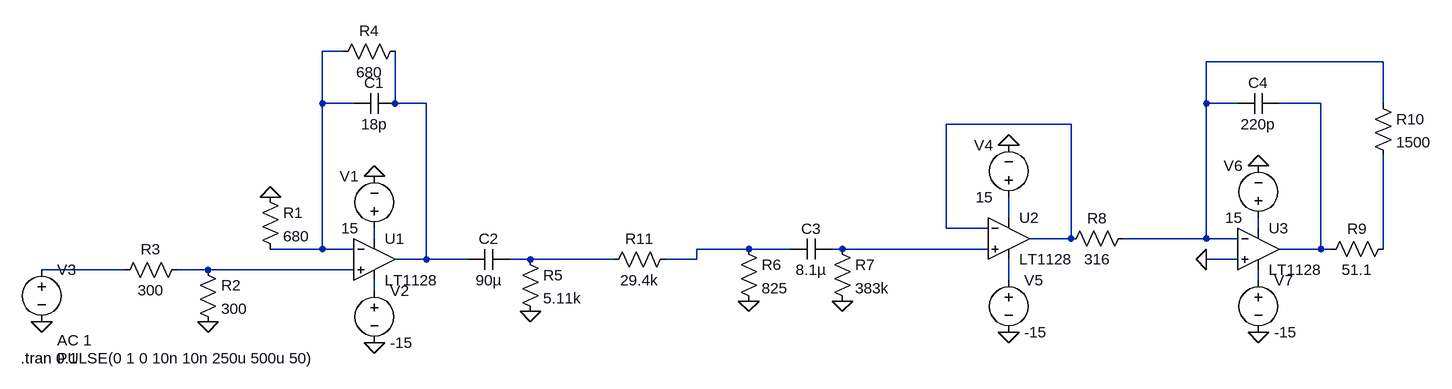
[diagram p0: schematic Circuit_from_a_microwave_freq_counter.asc]
Circuit_from_a_microwave_freq_counter.asc, the LTspice schematic file:
Version 4
SHEET 1 1876 680
WIRE 192 -176 160 -176
WIRE 1792 -160 1520 -160
WIRE 160 -96 160 -176
WIRE 208 -96 160 -96
WIRE 272 -96 272 -176
WIRE 320 -96 272 -96
WIRE 1520 -96 1520 -160
WIRE 1568 -96 1520 -96
WIRE 1696 -96 1632 -96
WIRE 1792 -96 1792 -160
WIRE 1312 -64 1120 -64
WIRE 1216 80 1216 48
WIRE 1120 96 1120 -64
WIRE 1184 96 1120 96
WIRE 1600 96 1600 80
WIRE 240 112 240 96
WIRE 1312 112 1312 -64
WIRE 1312 112 1248 112
WIRE 1520 112 1520 -96
WIRE 1520 112 1392 112
WIRE 1568 112 1520 112
WIRE 160 128 160 -96
WIRE 160 128 80 128
WIRE 208 128 160 128
WIRE 816 128 736 128
WIRE 880 128 816 128
WIRE 960 128 944 128
WIRE 1184 128 960 128
WIRE 1696 128 1696 -96
WIRE 1696 128 1632 128
WIRE 1712 128 1696 128
WIRE 1792 128 1792 -16
WIRE 320 144 320 -96
WIRE 320 144 272 144
WIRE 384 144 320 144
WIRE 480 144 448 144
WIRE 608 144 480 144
WIRE 736 144 736 128
WIRE 736 144 688 144
WIRE 1568 144 1520 144
WIRE -144 160 -272 160
WIRE -16 160 -64 160
WIRE 208 160 -16 160
WIRE 1216 176 1216 144
WIRE 1600 176 1600 160
WIRE 240 192 240 176
FLAG 80 48 0
FLAG -16 240 0
FLAG 240 16 0
FLAG 240 272 0
FLAG 480 224 0
FLAG -272 240 0
FLAG 816 208 0
FLAG 960 208 0
FLAG 1216 -32 0
FLAG 1216 256 0
FLAG 1600 0 0
FLAG 1600 256 0
FLAG 1520 144 0
SYMBOL OpAmps\\LT1128 240 80 R0
SYMATTR InstName U1
SYMBOL res 64 32 R0
SYMATTR InstName R1
SYMATTR Value 680
SYMBOL res -32 144 R0
SYMATTR InstName R2
SYMATTR Value 300
SYMBOL res -48 144 R90
WINDOW 0 0 56 VBottom 2
WINDOW 3 32 56 VTop 2
SYMATTR InstName R3
SYMATTR Value 300
SYMBOL voltage 240 112 R180
WINDOW 0 24 96 Left 2
WINDOW 3 24 16 Left 2
WINDOW 123 0 0 Left 0
WINDOW 39 0 0 Left 0
SYMATTR InstName V1
SYMATTR Value 15
SYMBOL voltage 240 176 R0
WINDOW 123 0 0 Left 0
WINDOW 39 0 0 Left 0
SYMATTR InstName V2
SYMATTR Value -15
SYMBOL cap 272 -112 R90
WINDOW 0 0 32 VBottom 2
WINDOW 3 32 32 VTop 2
SYMATTR InstName C1
SYMATTR Value 18p
SYMBOL res 288 -192 R90
WINDOW 0 0 56 VBottom 2
WINDOW 3 32 56 VTop 2
SYMATTR InstName R4
SYMATTR Value 680
SYMBOL cap 448 128 R90
WINDOW 0 0 32 VBottom 2
WINDOW 3 32 32 VTop 2
SYMATTR InstName C2
SYMATTR Value 90µ
SYMBOL res 464 128 R0
SYMATTR InstName R5
SYMATTR Value 5.11k
SYMBOL voltage -272 144 R0
WINDOW 3 24 152 Left 2
WINDOW 123 24 124 Left 2
WINDOW 39 0 0 Left 0
SYMATTR Value PULSE(0 1 0 10n 10n 250u 500u 50)
SYMATTR Value2 AC 1
SYMATTR InstName V3
SYMBOL res 800 112 R0
SYMATTR InstName R6
SYMATTR Value 825
SYMBOL cap 944 112 R90
WINDOW 0 0 32 VBottom 2
WINDOW 3 32 32 VTop 2
SYMATTR InstName C3
SYMATTR Value 8.1µ
SYMBOL res 944 112 R0
SYMATTR InstName R7
SYMATTR Value 383k
SYMBOL OpAmps\\LT1128 1216 48 R0
SYMATTR InstName U2
SYMBOL voltage 1216 64 R180
WINDOW 0 24 96 Left 2
WINDOW 3 24 16 Left 2
WINDOW 123 0 0 Left 0
WINDOW 39 0 0 Left 0
SYMATTR InstName V4
SYMATTR Value 15
SYMBOL voltage 1216 160 R0
WINDOW 123 0 0 Left 0
WINDOW 39 0 0 Left 0
SYMATTR InstName V5
SYMATTR Value -15
SYMBOL res 1408 96 R90
WINDOW 0 0 56 VBottom 2
WINDOW 3 32 56 VTop 2
SYMATTR InstName R8
SYMATTR Value 316
SYMBOL OpAmps\\LT1128 1600 64 R0
SYMATTR InstName U3
SYMBOL voltage 1600 96 R180
WINDOW 0 24 96 Left 2
WINDOW 3 24 16 Left 2
WINDOW 123 0 0 Left 0
WINDOW 39 0 0 Left 0
SYMATTR InstName V6
SYMATTR Value 15
SYMBOL voltage 1600 160 R0
WINDOW 123 0 0 Left 0
WINDOW 39 0 0 Left 0
SYMATTR InstName V7
SYMATTR Value -15
SYMBOL cap 1632 -112 R90
WINDOW 0 0 32 VBottom 2
WINDOW 3 32 32 VTop 2
SYMATTR InstName C4
SYMATTR Value 220p
SYMBOL res 1808 112 R90
WINDOW 0 0 56 VBottom 2
WINDOW 3 32 56 VTop 2
SYMATTR InstName R9
SYMATTR Value 51.1
SYMBOL res 1776 -112 R0
SYMATTR InstName R10
SYMATTR Value 1500
SYMBOL res 704 128 R90
WINDOW 0 0 56 VBottom 2
WINDOW 3 32 56 VTop 2
SYMATTR InstName R11
SYMATTR Value 29.4k
TEXT -304 296 Left 2 !.tran 0.1

The netlist it stands for:
* Circuit_from_a_microwave_freq_counter.asc
XU1 N014 N001 N008 N017 N003 LT1128  ; pins In+ In- V+ V- OUT
R1 0 N001 680
R2 N014 0 300
R3 N014 N013 300
V1 N008 0 15
V2 N017 0 -15
C1 N003 N001 18p
R4 N003 N001 680
C2 N012 N003 90µ
R5 N012 0 5.11k
V3 N013 0 PULSE(0 1 0 10n 10n 250u 500u 50) AC 1
R6 N009 0 825
C3 N010 N009 8.1µ
R7 N010 0 383k
XU2 N010 N005 N006 N015 N005 LT1128  ; pins In+ In- V+ V- OUT
V4 N006 0 15
V5 N015 0 -15
R8 N002 N005 316
XU3 0 N002 N007 N016 N004 LT1128  ; pins In+ In- V+ V- OUT
V6 N007 0 15
V7 N016 0 -15
C4 N004 N002 220p
R9 N011 N004 51.1
R10 N002 N011 1500
R11 N009 N012 29.4k
.tran 0.1
.lib LTC.lib
.backanno
.end